# Altium schematic sheet Sheet1.SchDoc
size A4; PageSetup: Record=PageOptions|CenterHorizontal=True|CenterVertical=True|PrintScale=1.00|XCorrection=1.00|YCorrection=1.00|PrintKind=1|BorderSize=5000000|LeftOffset=0|BottomOffset=0|Orientation=2|PaperLength=1000|PaperWidth=1000|Scale=100|PaperSource=7|PrintQuality=-3|MediaType=1|DitherType=10|PrintScaleMode=1|PaperKind=A3|PaperIndex=8
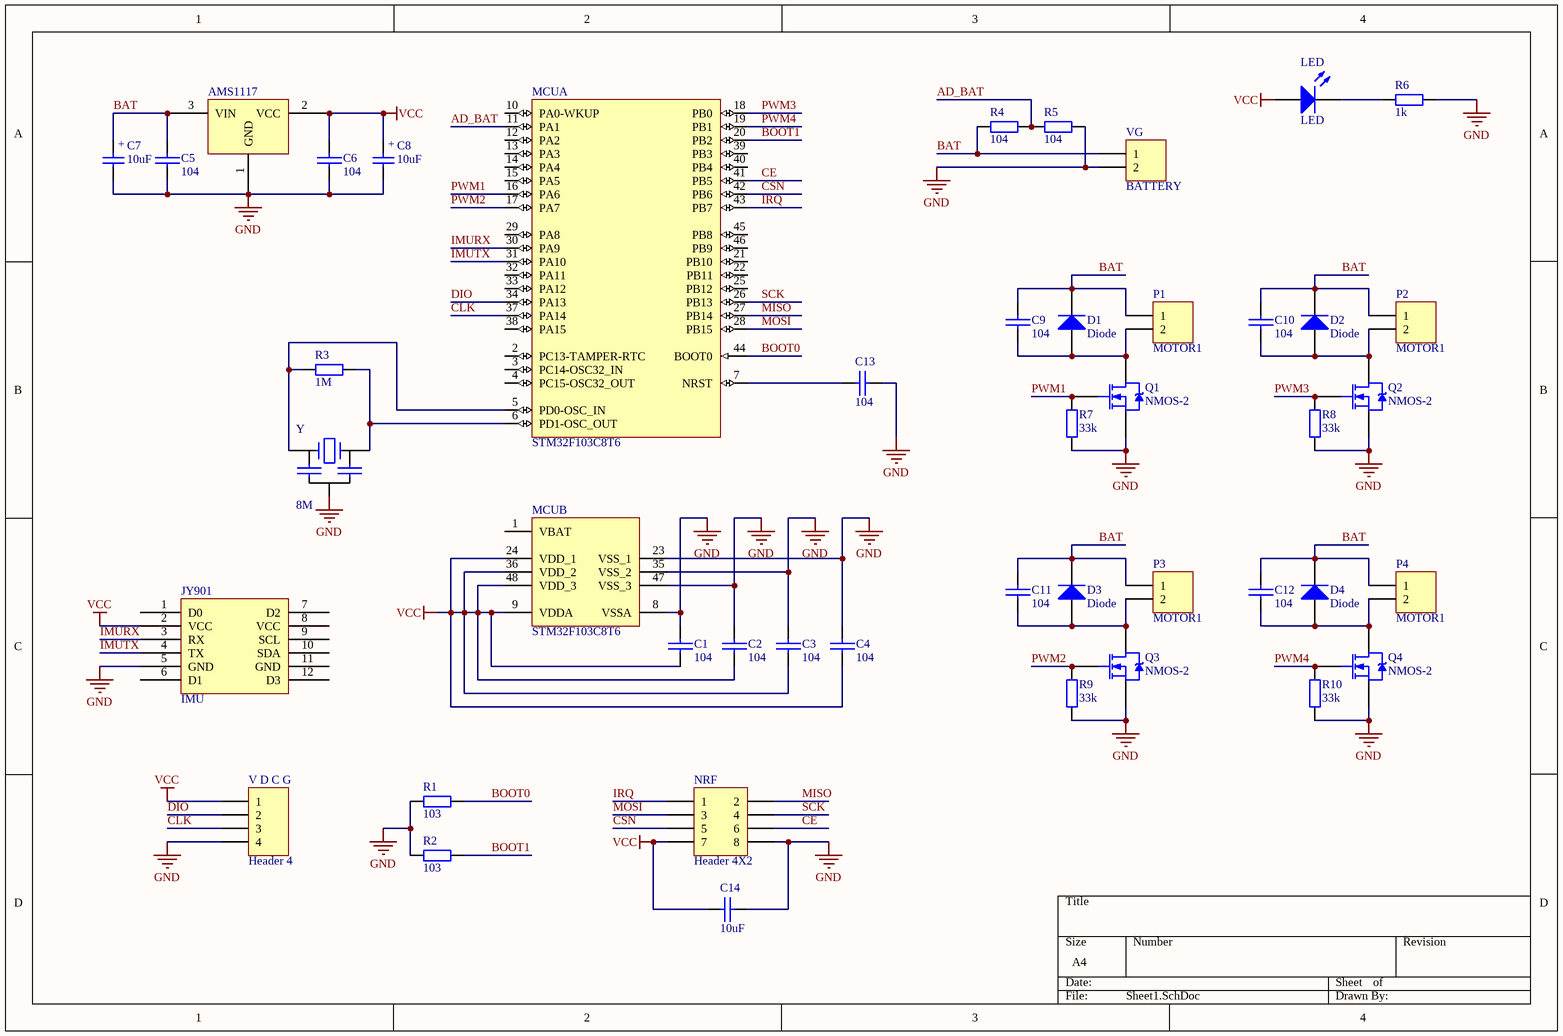
[diagram p0: Sheet1.SchDoc]

## Parts
AMS1117  (no value)  [LC-SOT-223]
C1  value 104  [C1608[0603]N]  (hidden comment: CAP)
C2  value 104  [C1608[0603]N]  (hidden comment: CAP)
C3  value 104  [C1608[0603]N]  (hidden comment: CAP)
C4  value 104  [C1608[0603]N]  (hidden comment: CAP)
C5  value 104  [C1608[0603]N]  (hidden comment: cap smd)
C6  value 104  [C1608[0603]N]  (hidden comment: cap smd)
C7  value 10uF  [C1206]  (hidden comment: Cap)
C8  value 10uF  [C1206]  (hidden comment: Cap)
C9  value 104  [C1608[0603]N]  (hidden comment: cap smd)
C10  value 104  [C1608[0603]N]  (hidden comment: cap smd)
C11  value 104  [C1608[0603]N]  (hidden comment: cap smd)
C12  value 104  [C1608[0603]N]  (hidden comment: cap smd)
C13  value 104  [C1608[0603]N]  (hidden comment: cap smd)
C14  value 10uF  [C2012[0805]N]  (hidden comment: cap smd)
D1  Diode  [D3216[1206]]
D2  Diode  [D3216[1206]]
D3  Diode  [D3216[1206]]
D4  Diode  [D3216[1206]]
JY901  IMU  [JY-901]
LED  LED  [3.2X1.6X1.1]
MCU  STM32F103C8T6  [STM-LQFP48_N]  (parts A,B of 2)
NRF  Header 4X2  [HDR2X4]
P1  MOTOR1  [HDR1X2]
P2  MOTOR1  [HDR1X2]
P3  MOTOR1  [HDR1X2]
P4  MOTOR1  [HDR1X2]
Q1  NMOS-2  [LC-SOT-23]
Q2  NMOS-2  [LC-SOT-23]
Q3  NMOS-2  [LC-SOT-23]
Q4  NMOS-2  [LC-SOT-23]
R1  value 103  [R1608[0603]]  (hidden comment: RES1)
R2  value 103  [R1608[0603]]  (hidden comment: RES1)
R3  value 1M  [R1608[0603]]  (hidden comment: RES1)
R4  value 104  [R1608[0603]]  (hidden comment: RES1)
R5  value 104  [R1608[0603]]  (hidden comment: RES1)
R6  value 1k  [R1608[0603]]  (hidden comment: RES1)
R7  value 33k  [R1608[0603]]  (hidden comment: RES1)
R8  value 33k  [R1608[0603]]  (hidden comment: RES1)
R9  value 33k  [R1608[0603]]  (hidden comment: RES1)
R10  value 33k  [R1608[0603]]  (hidden comment: RES1)
V_D_C_G  Header 4  [HDR1X4]
VG  BATTERY  [HDR1X2]
Y  8M  [Crystal_C]

## Nets
GND: AMS1117.1(GND) C1.1 C2.1 C3.1 C4.1 C5.2 C6.2 C7.2(-) C8.2(-) C13.2 C14.2 JY901.5(GND) MCU.8(VSSA) MCU.23(VSS_1) MCU.35(VSS_2) MCU.47(VSS_3) NRF.8 Q1.2(S) Q2.2(S) Q3.2(S) Q4.2(S) R1.1 R2.1 R5.2 R6.2 R7.1 R8.1 R9.1 R10.1 V_D_C_G.4 VG.2 Y.2(GND)
VCC: AMS1117.2(VCC) C1.2 C2.2 C3.2 C4.2 C6.1 C8.1(+) C14.1 JY901.2(VCC) LED.1(A) MCU.9(VDDA) MCU.24(VDD_1) MCU.36(VDD_2) MCU.48(VDD_3) NRF.7 V_D_C_G.1
AD_BAT: MCU.11(PA1) R4.2 R5.1
BAT: AMS1117.3(VIN) C5.1 C7.1(+) C9.1 C10.1 C11.1 C12.1 D1.2(K) D2.2(K) D3.2(K) D4.2(K) P1.1 P2.1 P3.1 P4.1 R4.1 VG.1
BOOT0: MCU.44(BOOT0) R1.2
BOOT1: MCU.20(PB2) R2.2
CE: MCU.41(PB5) NRF.6
CLK: MCU.37(PA14) V_D_C_G.3
CSN: MCU.42(PB6) NRF.5
DIO: MCU.34(PA13) V_D_C_G.2
IMURX: JY901.3(RX) MCU.30(PA9)
IMUTX: JY901.4(TX) MCU.31(PA10)
IRQ: MCU.43(PB7) NRF.1
MISO: MCU.27(PB14) NRF.2
MOSI: MCU.28(PB15) NRF.3
PWM1: MCU.16(PA6) Q1.1(G) R7.2
PWM2: MCU.17(PA7) Q3.1(G) R9.2
PWM3: MCU.18(PB0) Q2.1(G) R8.2
PWM4: MCU.19(PB1) Q4.1(G) R10.2
SCK: MCU.26(PB13) NRF.4
NetC9_2: C9.2 D1.1(A) P1.2 Q1.3(D)
NetC10_2: C10.2 D2.1(A) P2.2 Q2.3(D)
NetC11_2: C11.2 D3.1(A) P3.2 Q3.3(D)
NetC12_2: C12.2 D4.1(A) P4.2 Q4.3(D)
NetC13_1: C13.1 MCU.7(NRST)
NetLED_2: LED.2(K) R6.1
NetMCU_5: MCU.5(PD0-OSC_IN) R3.2 Y.1
NetMCU_6: MCU.6(PD1-OSC_OUT) R3.1 Y.3

Not connected (* = marked no-connect by the designer): JY901 1(D0) 6(D1) 7(D2) 8(VCC) 9(SCL) 10(SDA) 11(GND) 12(D3); MCU 1(VBAT) 2(PC13-TAMPER-RTC) 3(PC14-OSC32_IN) 4(PC15-OSC32_OUT) 10(PA0-WKUP) 12(PA2) 13(PA3) 14(PA4) 15(PA5) 21(PB10) 22(PB11) 25(PB12) 29(PA8) 32(PA11) 33(PA12) 38(PA15) 39(PB3) 40(PB4) 45(PB8) 46(PB9)

## Library data of the parts
AMS1117 = LC-SOT-233
C1-C6 C9-C14 = CAP: 贴片无极性电容
C7 C8 = Cap Pol S: 贴片极性电容
D1-D4 = Diode: Default Diode; Published: 8-Jun-2000; LatestRevisionDate: 17-Jul-2002; LatestRevisionNote: Re-released for DXP Platform.; PackageDocument: Sep-1996; PackageReference: SMC; Publisher: Altium Limited; Code_JEDEC: DO-214-AB
JY901 = JY901
LED = LED2: Typical RED, GREEN, YELLOW, AMBER GaAs LED; Published: 8-Jun-2000; LatestRevisionDate: 17-Jul-2002; LatestRevisionNote: Re-released for DXP Platform.; PackageDocument: Feb-2002; PackageReference: 3.2X1.6X1.1; Publisher: Altium Limited
MCU = STM32F103C8T6: ARM Cortex-M3 32-bit MCU, 64 KB Flash, 20 KB Internal RAM, 37 I/Os, 48-pin LQFP, -40 to 85 degC, Tray; A/D Converter: 2x12-bit (10 Channel); FLASH Size (Prog) (kB): 64; I/Os (High Current): 37; Internal RAM Size (kB): 20; Operating Frequency(F) (Processor speed) (MHz): 72; Supply Voltage(Vcc) min (V): 2; DatasheetVersion: Rev. 16; PackageVersion: Rev. 6, 06/2013; PackageReference: LQFP48; PackageDescription: 48-Pin Low Profile Quad Flat Package, 7 x 7 mm Body, 0.5 mm Pitch; Supplier 1: Digi-Key; Supplier Part Number 1: 497-6063-ND; Supplier 2: Farnell; Supplier Part Number 2: 1447637; Supplier 3: Newark; Supplier Part Number 3: 59M2182; Supplier 4: Newark; Supplier Part Number 4: 57P1222; Supplier 5: Mouser; Supplier Part Number 5: 511-STM32F103C8T6; Core: ARM Cortex-M3; Packing: Tray; Mounting Technology: Surface Mount; PartNumber: STM32F103C8T6; ComponentLink1Description: Manufacturer URL; ComponentLink1URL: http://www.st.com/web/en/home.html; ComponentLink2Description: Datasheet; ComponentLink2URL: http://www.st.com/st-web-ui/static/active/en/resource/technical/document/datasheet/CD00161566.pdf; ComponentLink3Description: Package Specification; ComponentLink3URL: http://www.st.com/st-web-ui/static/active/en/resource/technical/document/datasheet/DM00058181.pdf
NRF = Header 4X2: Header, 4-Pin, Dual row; LatestRevisionDate: 17-Jul-2002; LatestRevisionNote: Re-released for DXP Platform.; Publisher: Altium Limited
P1-P4 VG = Header 2: Header, 2-Pin; LatestRevisionDate: 17-Jul-2002; LatestRevisionNote: Re-released for DXP Platform.; Publisher: Altium Limited
Q1-Q4 = NMOS-2: N-Channel Power MOSFET; Note: Pin 2 is electrically connected to pin 4.; Published: 8-Jun-2000; LatestRevisionDate: 17-Jul-2002; LatestRevisionNote: Re-released for DXP Platform.; DatasheetVersion: PD-9.814; PackageVersion: Feb-1997; PackageReference: TO-220AB; Publisher: Altium Limited; PackageDescription: TO, Thru-Hole, Vertical, Heatsink Mounted; 3 In-Line Leads; Pitch 2.54 mm; ComponentLink1Description: Manufacturer Link; ComponentLink1URL: http://www.irf.com/
V_D_C_G = Header 4: Header, 4-Pin; LatestRevisionDate: 17-Jul-2002; LatestRevisionNote: Re-released for DXP Platform.; Publisher: Altium Limited
Y = CRYSTAL_C: Crystal